# Altium schematic sheet CAN_IF.SchDoc
size A4; SheetNumber: 3; SheetTotal: 5
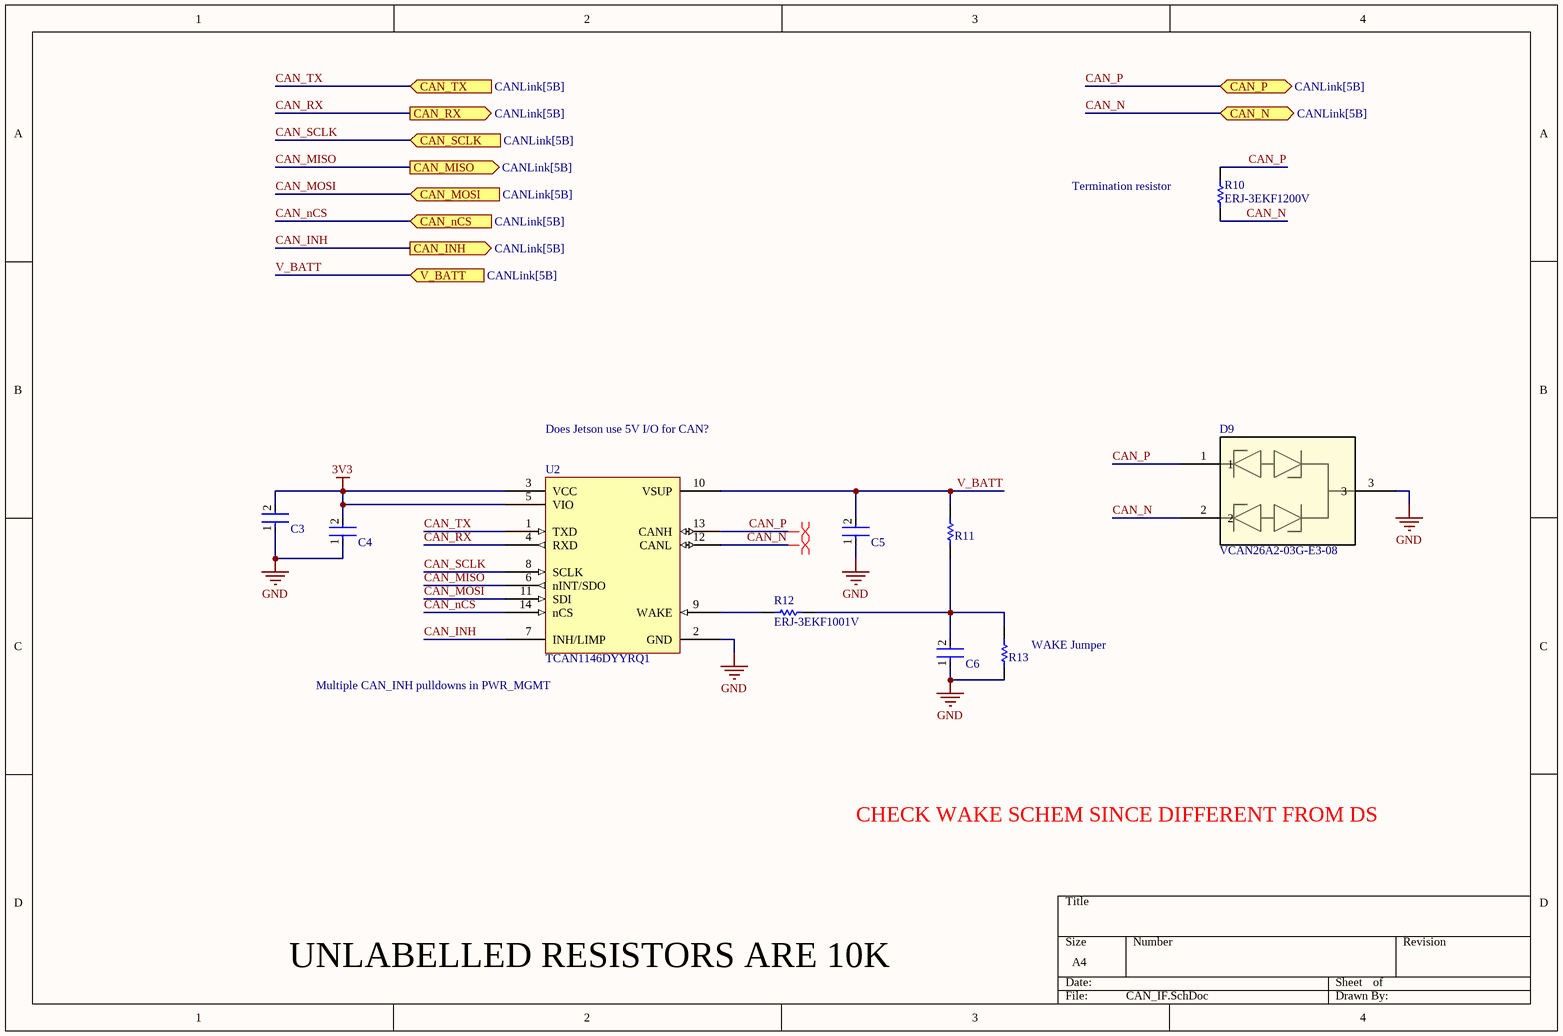
[diagram p0: CAN_IF.SchDoc]

## Parts
C3  C0402C104K8PACTU  [FP-C0402-BB-MFG]  (value not drawn)
C4  C0402C104K8PACTU  [FP-C0402-BB-MFG]  (value not drawn)
C5  C0402C104K8PACTU  [FP-C0402-BB-MFG]  (value not drawn)
C6  C0402C104K8PACTU  [FP-C0402-BB-MFG]  (value not drawn)
D9  VCAN26A2-03G-E3-08  [VCAN26A2-03G-E3-08-Footprint-1]
R10  ERJ-3EKF1200V  [RESC1609X55X30ML15T15]
R11  ERJ3EKF1002V  [RESC1609X55X30LL15T15]  (value not drawn)
R12  ERJ-3EKF1001V  [RESC1608X55X30LL15T15]
R13  0402 JUMPER 0 OHM  [RESC1005X40X25NL05T05]  (value not drawn)
U2  TCAN1146DYYRQ1  [TCAN1146DYYRQ1-Footprint-1]

## Ports
CAN_INH (out, see CANLink[5B]), CAN_MISO (out, see CANLink[5B]), CAN_MOSI (in, see CANLink[5B]), CAN_N (bidir, see CANLink[5B]), CAN_nCS (in, see CANLink[5B]), CAN_P (bidir, see CANLink[5B]), CAN_RX (out, see CANLink[5B]), CAN_SCLK (in, see CANLink[5B]), CAN_TX (in, see CANLink[5B]), V_BATT (in, see CANLink[5B])

## Nets
3V3: C3.2 C4.2 U2.3(VCC) U2.5(VIO)
GND: C3.1 C4.1 C5.1 C6.1 D9.3 R13.1 U2.2(GND)
CAN_INH: U2.7(INH/LIMP) ; port CAN_INH
CAN_MISO: U2.6(nINT/SDO) ; port CAN_MISO
CAN_MOSI: U2.11(SDI) ; port CAN_MOSI
CAN_N: D9.2 R10.1 U2.12(CANL) ; port CAN_N
CAN_nCS: U2.14(nCS) ; port CAN_nCS
CAN_P: D9.1 R10.2 U2.13(CANH) ; port CAN_P
CAN_RX: U2.4(RXD) ; port CAN_RX
CAN_SCLK: U2.8(SCLK) ; port CAN_SCLK
CAN_TX: U2.1(TXD) ; port CAN_TX
V_BATT: C5.2 R11.1 U2.10(VSUP) ; port V_BATT
NetC6_2: C6.2 R11.2 R12.2 R13.2
NetR12_1: R12.1 U2.9(WAKE)

## Layout directives
differential pair: CAN_N, CAN_P

## Notes on the sheet
- (near R10) Termination resistor
- Does Jetson use 5V I/O for CAN?
- (near R13) WAKE Jumper
- (near U2) Multiple CAN_INH pulldowns in PWR_MGMT
- CHECK WAKE SCHEM SINCE DIFFERENT FROM DS
- UNLABELLED RESISTORS ARE 10K

## Library data of the parts
C3-C6 = CMP-2008-02046-2: CAP CER 0.1UF 10V X5R 0402; Manufacturer: Kemet; Material: Ceramic; Capacitance: 0.10 μF; Temperature Coefficient: 15%; Tolerance: 0.1; Value: 0.10 μF; Package: C0402-BB; Temperature: -55°C to +125°C; ComponentLink2Description: Datasheet; Temperature Characteristic: X5R; Device Class L1: Passive Components; Height: 0.55mm; Lead Free: Yes; ComponentLink2URL: https://content.kemet.com/datasheets/KEM_C1002_X7R_SMD.pdf; Device Class L2: Capacitors; Temperature Range Low: -55°C; Temperature Range High: +125°C; RoHS: TRUE; Octopart: https://octopart.com/c0402c104k8pactu-kemet-140039; Automotive: No; Mouser Description: Capacitor 100 nF 10 VDC 0402; Category: Cap; Voltage Rating: 10 V; Digikey Description: CAP CER 0.1UF 10V X5R 0402; Ipc Land Pattern Name: CAPC10050X50; Device Class L3: Ceramic Capacitors; Manufacturer Part Number: C0402C104K8PACTU
D9 = CMP-004-00042-1: ESD Suppressor Diode TVS Bi-Dir 26.5V 3-Pin SOT-323 T/R
R10 = CMP-2000-00213-2: Chip Resistor, 120 Ohm, +/- 1%, 0.1 W, -55 to 155 degC, 0603 (1608 Metric), RoHS, Tape and Reel; Manufacturer: Panasonic; Power Rating: 100mW; Voltage Rating (DC): 75V; Resistance: 120Ohm; Temperature Coefficient: 100ppm/degreesC; Number of Terminations: 2; Military Standard: Not; Tolerance: 1%; Min Operating Temperature: -55degC; Packaging: TapeandReel; Lead Free: LeadFree; Max Operating Temperature: 155degC; Manufacturer URL: http://www.panasonic.com/; Case Code (Imperial): 0603; REACH SVHC: NoSVHC; Width: 0.031inch; Datasheet URL: https://industrial.panasonic.com/cdbs/www-data/pdf/RDA0000/AOA0000C283.pdf; RoHSCompliant: true; Max Power Dissipation: 100mW; Termination: SMD/SMT; Package Reference: 0603; Height: 0.022inch; Depth: 0.8mm; Package Description: 2-Pin Surface Mount Device, Body 1.6 x 0.85 mm; Contact Plating: Tin; Length: 1.6mm; Package URL: http://www.st.com/st-web-ui/static/active/en/resource/technical/document/datasheet/CD00001320.pdf; Radiation Hardening: No; Package Quantity: 1; Number of Pins: 2; Datasheet Version: 42095.0; Voltage Rating: 75V; Composition: ThickFilm; Case/Package: 0603; Mount: SurfaceMount; Case Code (Metric): 1608
R11 = CMP-1012-00623-3: Chip Resistor, 10 KOhm, +/- 1%, 0.1 W, -55 to 155 degC, 0603 (1608 Metric), RoHS, Tape and Reel; Manufacturer: Panasonic; Voltage Rating: 75V; Case\/Package: 0603; Power Rating: 100mW; Resistance: 10KOhm; Temperature Coefficient: 100ppm\/degreesC; Number of Pins: 2; Package Reference: 603; Depth: 0.8mm; Mount: SurfaceMount; Package Description: 2-Pin Surface Mount Device, Body 1.6 x 0.85 mm; Datasheet Version: 02/2017; Length: 1.6mm; Lead Free: LeadFree; Height: 0.45mm; Number of Terminations: 2; Max Power Dissipation: 100mW; Min Operating Temperature: -55degC; Datasheet URL: https://industrial.panasonic.com/cdbs/www-data/pdf/RDA0000/AOA0000C304.pdf; Termination: SMD/SMT; Case Code (Metric): 1608; Case Code (Imperial): 0603; Tolerance: 1%; Max Operating Temperature: 155degC; RoHSCompliant: true; Voltage Rating (DC): 75V; Radiation Hardening: No; Packaging: TapeandReel; Composition: ThickFilm; Mounting Technology: SurfaceMount; Manufacturer URL: http://www.panasonic.com/; Width: 0.031inch; REACH SVHC: NoSVHC; Contact Plating: Tin; Military Standard: Not; Package Quantity: 1
R12 = CMP-2000-00180-1: Manufacturer: Panasonic; Part Number: ERJ-3EKF1001V
R13 = CMP-009-00206-2: READ THE NAME
U2 = CMP-015-00012-2: Automotive CAN FD transceiver with watchdog, bus diagnostics and partial networking via sele 14-SOT-23-THIN -40 to 150